# Altium schematic sheet 05_FEED.SchDoc
size A4
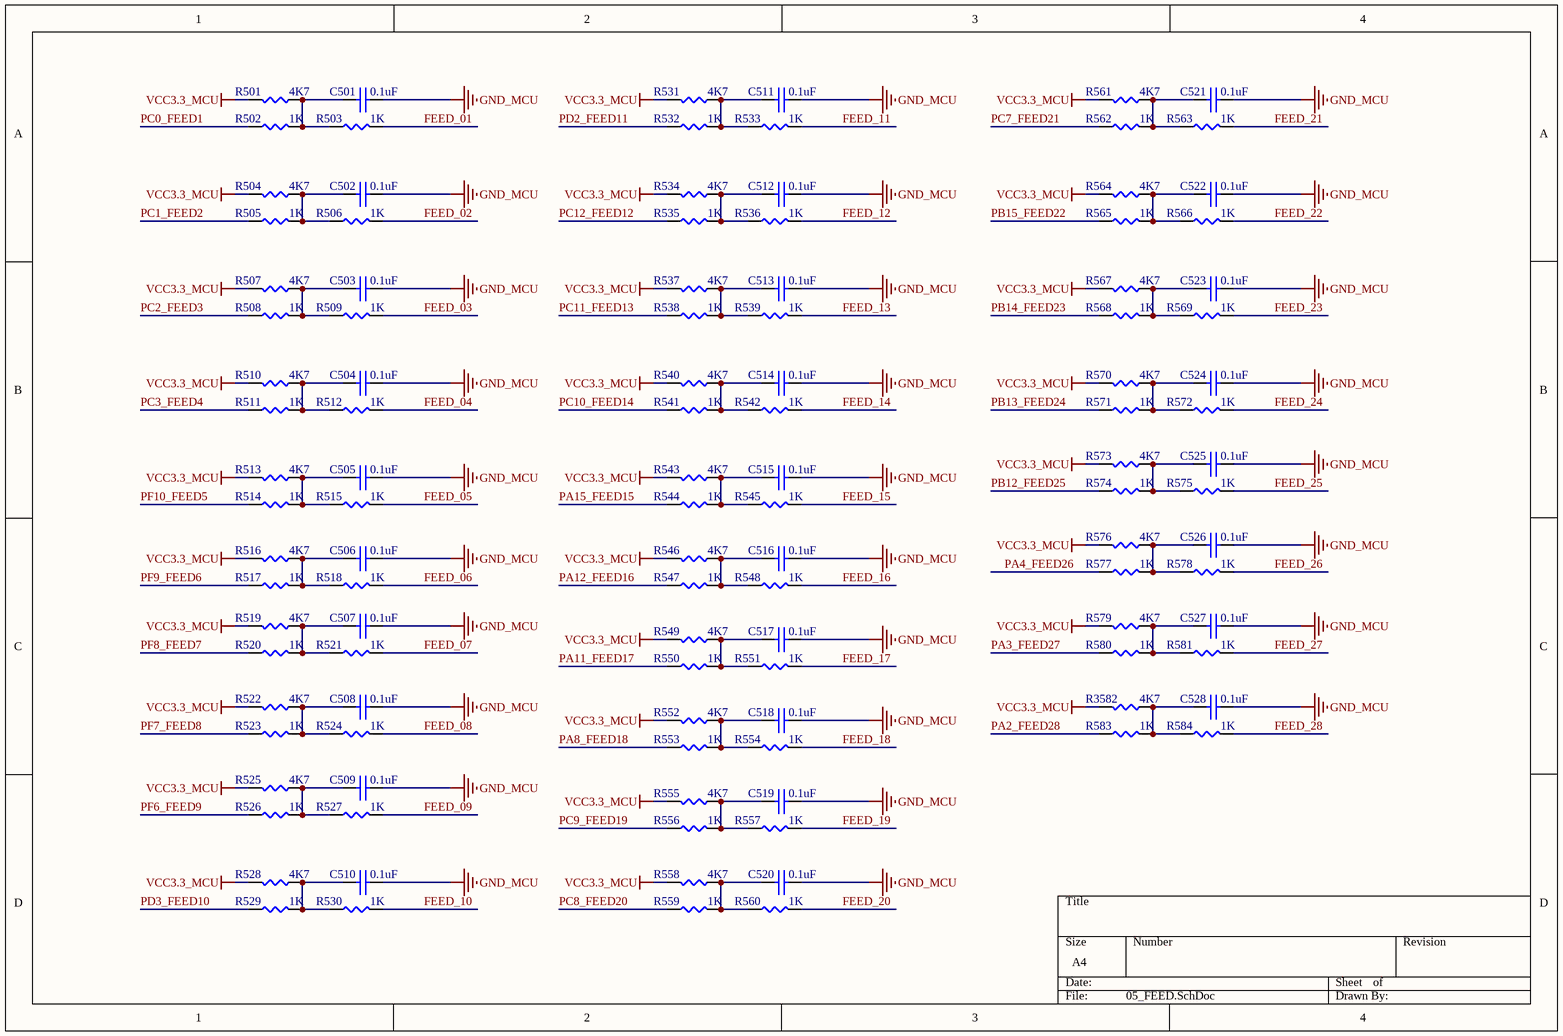
[diagram p0: 05_FEED.SchDoc]

## Parts
C501  0.1uF  [0603C]
C502  0.1uF  [0603C]
C503  0.1uF  [0603C]
C504  0.1uF  [0603C]
C505  0.1uF  [0603C]
C506  0.1uF  [0603C]
C507  0.1uF  [0603C]
C508  0.1uF  [0603C]
C509  0.1uF  [0603C]
C510  0.1uF  [0603C]
C511  0.1uF  [0603C]
C512  0.1uF  [0603C]
C513  0.1uF  [0603C]
C514  0.1uF  [0603C]
C515  0.1uF  [0603C]
C516  0.1uF  [0603C]
C517  0.1uF  [0603C]
C518  0.1uF  [0603C]
C519  0.1uF  [0603C]
C520  0.1uF  [0603C]
C521  0.1uF  [0603C]
C522  0.1uF  [0603C]
C523  0.1uF  [0603C]
C524  0.1uF  [0603C]
C525  0.1uF  [0603C]
C526  0.1uF  [0603C]
C527  0.1uF  [0603C]
C528  0.1uF  [0603C]
R501  4K7  [0603R]
R502  1K  [0603R]
R503  1K  [0603R]
R504  4K7  [0603R]
R505  1K  [0603R]
R506  1K  [0603R]
R507  4K7  [0603R]
R508  1K  [0603R]
R509  1K  [0603R]
R510  4K7  [0603R]
R511  1K  [0603R]
R512  1K  [0603R]
R513  4K7  [0603R]
R514  1K  [0603R]
R515  1K  [0603R]
R516  4K7  [0603R]
R517  1K  [0603R]
R518  1K  [0603R]
R519  4K7  [0603R]
R520  1K  [0603R]
R521  1K  [0603R]
R522  4K7  [0603R]
R523  1K  [0603R]
R524  1K  [0603R]
R525  4K7  [0603R]
R526  1K  [0603R]
R527  1K  [0603R]
R528  4K7  [0603R]
R529  1K  [0603R]
R530  1K  [0603R]
R531  4K7  [0603R]
R532  1K  [0603R]
R533  1K  [0603R]
R534  4K7  [0603R]
R535  1K  [0603R]
R536  1K  [0603R]
R537  4K7  [0603R]
R538  1K  [0603R]
R539  1K  [0603R]
R540  4K7  [0603R]
R541  1K  [0603R]
R542  1K  [0603R]
R543  4K7  [0603R]
R544  1K  [0603R]
R545  1K  [0603R]
R546  4K7  [0603R]
R547  1K  [0603R]
R548  1K  [0603R]
R549  4K7  [0603R]
R550  1K  [0603R]
R551  1K  [0603R]
R552  4K7  [0603R]
R553  1K  [0603R]
R554  1K  [0603R]
R555  4K7  [0603R]
R556  1K  [0603R]
R557  1K  [0603R]
R558  4K7  [0603R]
R559  1K  [0603R]
R560  1K  [0603R]
R561  4K7  [0603R]
R562  1K  [0603R]
R563  1K  [0603R]
R564  4K7  [0603R]
R565  1K  [0603R]
R566  1K  [0603R]
R567  4K7  [0603R]
R568  1K  [0603R]
R569  1K  [0603R]
R570  4K7  [0603R]
R571  1K  [0603R]
R572  1K  [0603R]
R573  4K7  [0603R]
R574  1K  [0603R]
R575  1K  [0603R]
R576  4K7  [0603R]
R577  1K  [0603R]
R578  1K  [0603R]
R579  4K7  [0603R]
R580  1K  [0603R]
R581  1K  [0603R]
R583  1K  [0603R]
R584  1K  [0603R]
R3582  4K7  [0603R]

## Nets
GND_MCU: C501.2 C502.2 C503.2 C504.2 C505.2 C506.2 C507.2 C508.2 C509.2 C510.2 C511.2 C512.2 C513.2 C514.2 C515.2 C516.2 C517.2 C518.2 C519.2 C520.2 C521.2 C522.2 C523.2 C524.2 C525.2 C526.2 C527.2 C528.2
VCC3.3_MCU: R501.2 R504.2 R507.2 R510.2 R513.2 R516.2 R519.2 R522.2 R525.2 R528.2 R531.2 R534.2 R537.2 R540.2 R543.2 R546.2 R549.2 R552.2 R555.2 R558.2 R561.2 R564.2 R567.2 R570.2 R573.2 R576.2 R579.2 R3582.2
FEED_01: R503.2
FEED_02: R506.2
FEED_03: R509.2
FEED_04: R512.2
FEED_05: R515.2
FEED_06: R518.2
FEED_07: R521.2
FEED_08: R524.2
FEED_09: R527.2
FEED_10: R530.2
FEED_11: R533.2
FEED_12: R536.2
FEED_13: R539.2
FEED_14: R542.2
FEED_15: R545.2
FEED_16: R548.2
FEED_17: R551.2
FEED_18: R554.2
FEED_19: R557.2
FEED_20: R560.2
FEED_21: R563.2
FEED_22: R566.2
FEED_23: R569.2
FEED_24: R572.2
FEED_25: R575.2
FEED_26: R578.2
FEED_27: R581.2
FEED_28: R584.2
PA2_FEED28: R583.1
PA3_FEED27: R580.1
PA4_FEED26: R577.1
PA8_FEED18: R553.1
PA11_FEED17: R550.1
PA12_FEED16: R547.1
PA15_FEED15: R544.1
PB12_FEED25: R574.1
PB13_FEED24: R571.1
PB14_FEED23: R568.1
PB15_FEED22: R565.1
PC0_FEED1: R502.1
PC1_FEED2: R505.1
PC2_FEED3: R508.1
PC3_FEED4: R511.1
PC7_FEED21: R562.1
PC8_FEED20: R559.1
PC9_FEED19: R556.1
PC10_FEED14: R541.1
PC11_FEED13: R538.1
PC12_FEED12: R535.1
PD2_FEED11: R532.1
PD3_FEED10: R529.1
PF6_FEED9: R526.1
PF7_FEED8: R523.1
PF8_FEED7: R520.1
PF9_FEED6: R517.1
PF10_FEED5: R514.1
NetC501_1: C501.1 R501.1 R502.2 R503.1
NetC502_1: C502.1 R504.1 R505.2 R506.1
NetC503_1: C503.1 R507.1 R508.2 R509.1
NetC504_1: C504.1 R510.1 R511.2 R512.1
NetC505_1: C505.1 R513.1 R514.2 R515.1
NetC506_1: C506.1 R516.1 R517.2 R518.1
NetC507_1: C507.1 R519.1 R520.2 R521.1
NetC508_1: C508.1 R522.1 R523.2 R524.1
NetC509_1: C509.1 R525.1 R526.2 R527.1
NetC510_1: C510.1 R528.1 R529.2 R530.1
NetC511_1: C511.1 R531.1 R532.2 R533.1
NetC512_1: C512.1 R534.1 R535.2 R536.1
NetC513_1: C513.1 R537.1 R538.2 R539.1
NetC514_1: C514.1 R540.1 R541.2 R542.1
NetC515_1: C515.1 R543.1 R544.2 R545.1
NetC516_1: C516.1 R546.1 R547.2 R548.1
NetC517_1: C517.1 R549.1 R550.2 R551.1
NetC518_1: C518.1 R552.1 R553.2 R554.1
NetC519_1: C519.1 R555.1 R556.2 R557.1
NetC520_1: C520.1 R558.1 R559.2 R560.1
NetC521_1: C521.1 R561.1 R562.2 R563.1
NetC522_1: C522.1 R564.1 R565.2 R566.1
NetC523_1: C523.1 R567.1 R568.2 R569.1
NetC524_1: C524.1 R570.1 R571.2 R572.1
NetC525_1: C525.1 R573.1 R574.2 R575.1
NetC526_1: C526.1 R576.1 R577.2 R578.1
NetC527_1: C527.1 R579.1 R580.2 R581.1
NetC528_1: C528.1 R583.2 R584.1 R3582.1

## Library data of the parts
C501-C528 = 0603C
R501-R581 R583 R584 R3582 = 0603R